# Altium project 3D_Scanner_Final.PrjPcb
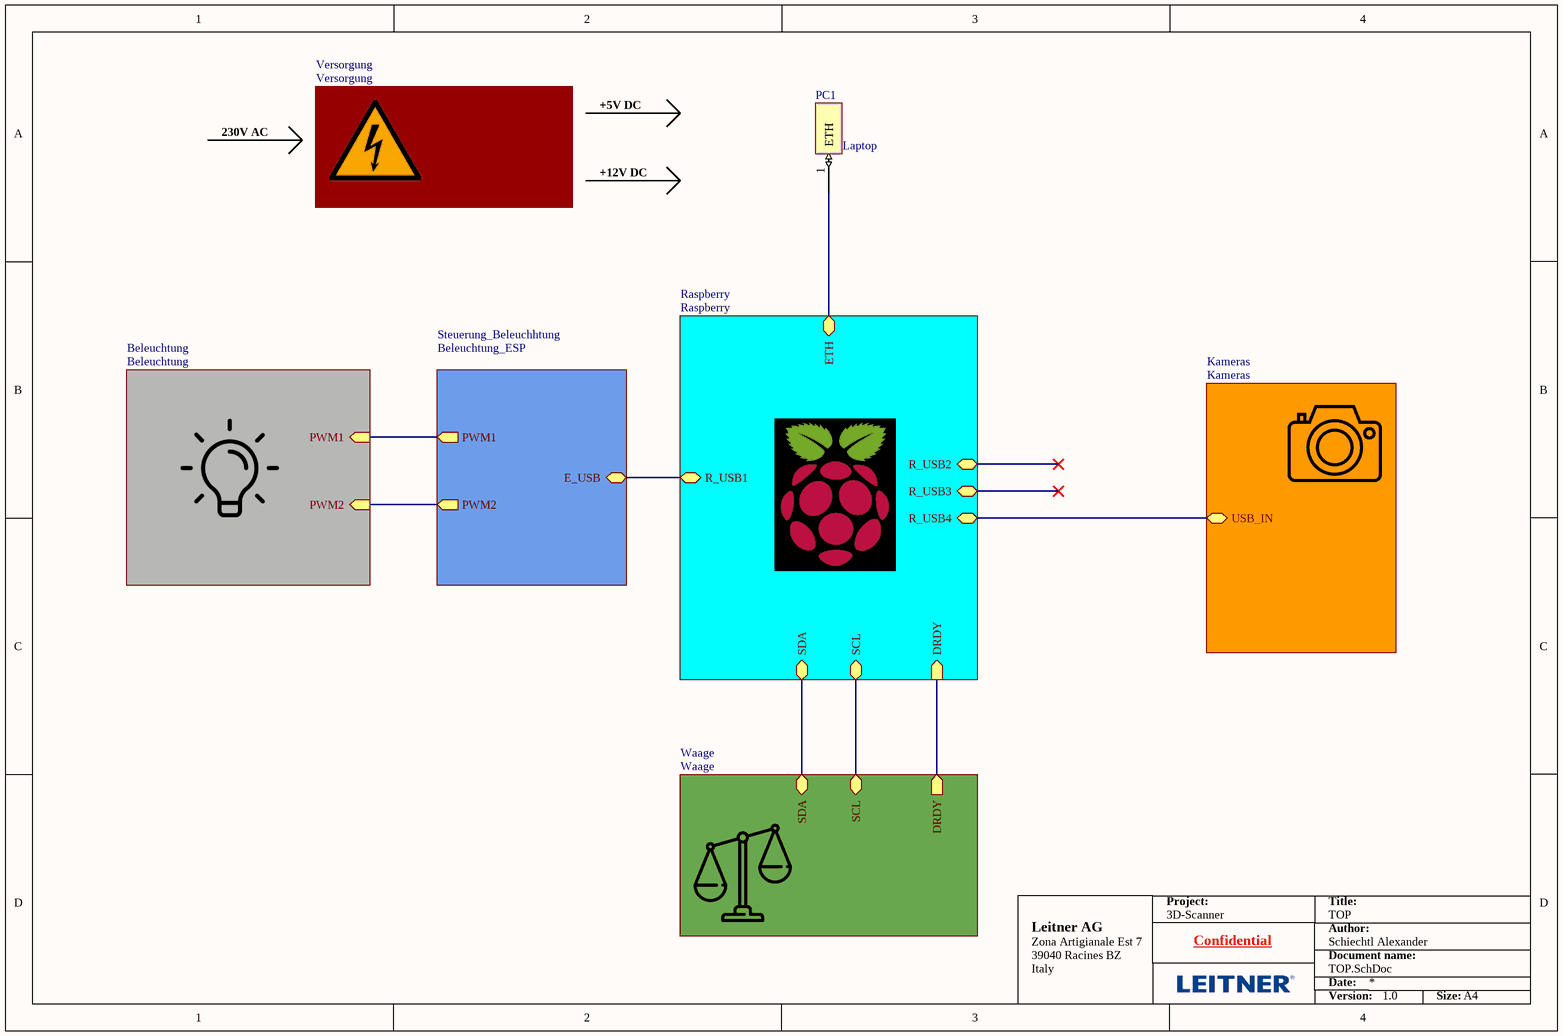
[diagram p0: TOP.SchDoc]
7 sheets, 27 parts. Net scope: hierarchical (ports join the sheet entries above them; power ports are global).
Sheets:
  TOP.SchDoc
    Kameras = Kameras.SchDoc
    Versorgung = Versorgung.SchDoc
    Raspberry = Raspberry.SchDoc
    Waage = Waage.SchDoc
    Beleuchtung = Beleuchtung.SchDoc
    Steuerung_Beleuchhtung = Beleuchtung_ESP.SchDoc

## Sheet TOP.SchDoc: TOP
size A4; Author: Schiechtl Alexander; Revision: 1.0; SheetNumber: 1; SheetTotal: 7; Project: 3D-Scanner

### Parts
PC1  Laptop

### Sub-sheets
Beleuchtung = Beleuchtung: PWM1 (in), PWM2 (in)
Kameras = Kameras: USB_IN (bidir)
Raspberry = Raspberry: R_USB1 (bidir), R_USB2 (bidir), R_USB3 (bidir), R_USB4 (bidir), SCL (bidir), SDA (bidir), DRDY (in), ETH (bidir)
Steuerung_Beleuchhtung = Beleuchtung_ESP: E_USB (bidir), PWM1 (out), PWM2 (out)
Versorgung = Versorgung: no entries
Waage = Waage: SCL (bidir), SDA (bidir), DRDY (out)

### Nets
NetESP1_?1: sheet Raspberry/R_USB1, sheet Steuerung_Beleuchhtung/E_USB
NetHUB1_2: sheet Kameras/USB_IN, sheet Raspberry/R_USB4
NetMUX1_3: sheet Raspberry/SDA, sheet Waage/SDA
NetMUX1_4: sheet Raspberry/SCL, sheet Waage/SCL
NetPC1_1: PC1.1(ETH) ; sheet Raspberry/ETH
NetR_RGB1_2: sheet Beleuchtung/PWM1, sheet Steuerung_Beleuchhtung/PWM1
NetR_RGB2_2: sheet Beleuchtung/PWM2, sheet Steuerung_Beleuchhtung/PWM2

### Buses and harness runs
bus sheet Raspberry/DRDY = sheet Waage/DRDY

### Notes on the sheet
- +5V DC
- 230V AC
- +12V DC
- Project:
- Title:
- Leitner AG
- Zona Artigianale Est 7
- 39040 Racines BZ
- Italy
- Confidential
- Author:
- Document name:
- Date:
- Version:
- Size:
- A4

## Sheet Kameras.SchDoc: Kameras
size A4; Date: 10.11.2025; Author: Schiechtl Alexander; SheetNumber: 2; SheetTotal: 7; Project: 3D_Scanner
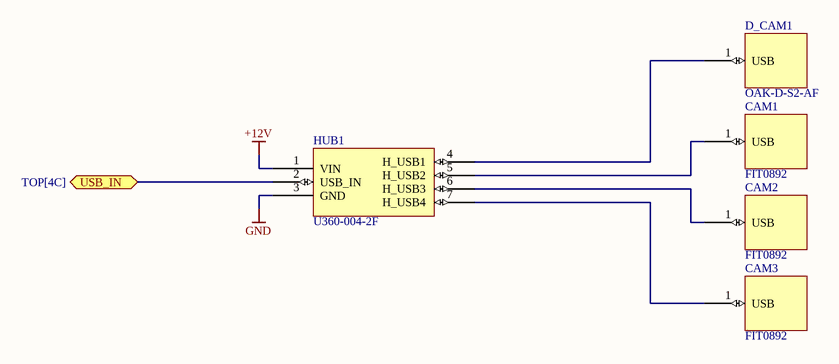
[diagram p1: Kameras.SchDoc]

### Parts
CAM1  FIT0892
CAM2  FIT0892
CAM3  FIT0892
D_CAM1  OAK-D-S2-AF
HUB1  U360-004-2F

### Ports
USB_IN (bidir, see TOP[4C])

### Nets
+12V: HUB1.1(VIN)
GND: HUB1.3(GND)
NetCAM1_1: CAM1.1(USB) HUB1.5(H_USB2)
NetCAM2_1: CAM2.1(USB) HUB1.6(H_USB3)
NetCAM3_1: CAM3.1(USB) HUB1.7(H_USB4)
NetD_CAM1_1: D_CAM1.1(USB) HUB1.4(H_USB1)
NetHUB1_2: HUB1.2(USB_IN) ; port USB_IN

### Notes on the sheet
- Project:
- Title:
- Leitner AG
- Zona Artigianale Est 7
- 39040 Racines BZ
- Italy
- Confidential
- Author:
- Document name:
- Date:
- Version:
- Size:
- A4

### Library data of the parts
CAM1-CAM3 = USB Kamera: Cameras & Camera Modules Megapixel 720p USB Wide-angle Camera for Raspberry Pi and NVIDIA Jetson Nano
D_CAM1 = Depth Kamera: Cameras & Camera Modules Robotic Perception Camera Series 2 with Auto Fcous, Stereo Depth, Object Tracking, Computer Vision, 4 TOPS of Processing Power for AI
HUB1 = USB HUB: Interface Modules 4PT USB3.0 SSSPD HUB/CHARGER

## Sheet Versorgung.SchDoc: Netzteil
size A4; Date: 10.11.2025; Author: Alexander Schiechtl; Revision: v1.0; SheetNumber: 4; SheetTotal: 6; Project: 3D-Scanner
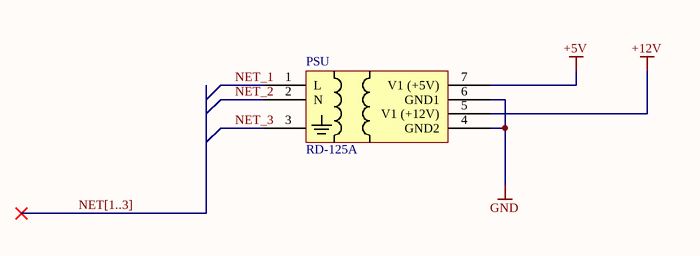
[diagram p2: Versorgung.SchDoc]

### Parts
PSU  RD-125A

### Nets
+5V: PSU.7(V1_(+5V))
+12V: PSU.5(V1_(+12V))
GND: PSU.4(GND2) PSU.6(GND1)
NET_1: PSU.1(L)
NET_2: PSU.2(N)
NET_3: PSU.3

### Buses and harness runs
bus NET[1..3]

### Notes on the sheet
- Project:
- Title:
- Leitner AG
- Zona Artigianale Est 7
- 39040 Racines BZ
- Italy
- Confidential
- Author:
- Document name:
- Date:
- Version:
- Size:
- A4

### Library data of the parts
PSU = PSU: MEAN WELL Schaltnetzteil, 5 V dc, 12 V dc / 7.7A 2-Kanal 130.9W 176 → 264 V ac, 248 → 373 V dc, 88

## Sheet Raspberry.SchDoc: Raspberry PI
size A4; Date: 10.11.2025; Author: Alexander Schiechtl; Revision: v1.1; SheetNumber: 3; SheetTotal: 7; Project: 3D-Scanner; SPICEModelCacheFICJDGAN: <root> / <DocumentId>FICJDGAN</DocumentId> / </root>
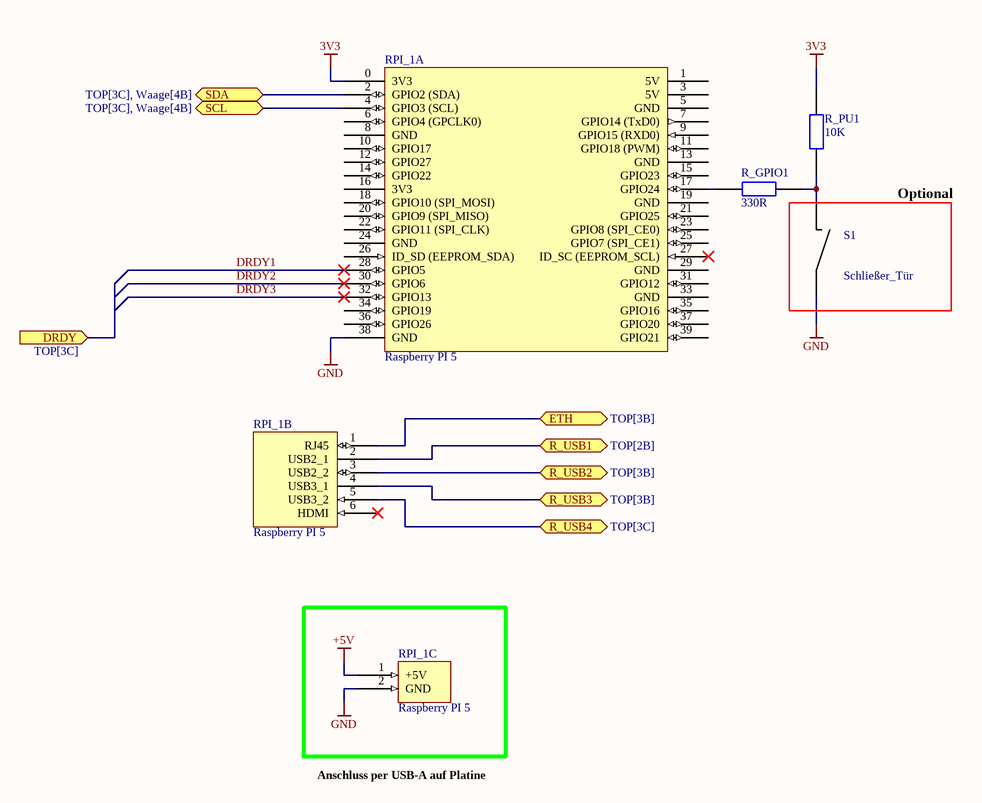
[diagram p3: Raspberry.SchDoc]

### Parts
(Parts that share a designator on the sheet are numbered #1, #2 ... from top to bottom, then left to right.)
R_GPIO1  330R
R_PU1  10K
RPI_1#1  Raspberry PI 5  (parts A,B of 2)
RPI_1#2  Raspberry PI 5  (part C of 3)
S1  Schließer_Tür

### Blocks framed on the sheet
Optional: S1

### Ports
DRDY (in, see TOP[3C]), ETH (bidir, see TOP[3B]), R_USB1 (bidir, see TOP[2B]), R_USB2 (bidir, see TOP[3B]), R_USB3 (bidir, see TOP[3B]), R_USB4 (bidir, see TOP[3C]), SCL (bidir, see TOP[3C], Waage[4B]), SDA (bidir, see TOP[3C], Waage[4B])

### Nets
3V3: R_PU1.1 RPI_1#1.0(3V3)
+5V: RPI_1#2.1(+5V)
GND: RPI_1#1.38(GND) RPI_1#2.2(GND)
DRDY1: RPI_1#1.28(GPIO5)
DRDY2: RPI_1#1.30(GPIO6)
DRDY3: RPI_1#1.32(GPIO13)
NetESP1_?1: RPI_1#1.2(USB2_1) ; port R_USB1
NetHUB1_2: RPI_1#1.5(GND) ; port R_USB4
NetMUX1_3: RPI_1#1.2(GPIO2_(SDA)) ; port SDA
NetMUX1_4: RPI_1#1.4(GPIO3_(SCL)) ; port SCL
NetPC1_1: RPI_1#1.1(5V) ; port ETH
NetR_GPIO1_0: R_GPIO1.0 R_PU1.0
NetR_GPIO1_1: R_GPIO1.1 RPI_1#1.17(GPIO24)
NetRPI_1#1_3: RPI_1#1.3(5V) ; port R_USB2
NetRPI_1#1_4: RPI_1#1.4(USB3_1) ; port R_USB3

Not connected (* = marked no-connect by the designer): RPI_1#1 6(GPIO4_(GPCLK0)) 7(GPIO14_(TxD0)) 8(GND) 9(GPIO15_(RXD0)) 10(GPIO17) 11(GPIO18_(PWM)) 12(GPIO27) 13(GND) 14(GPIO22) 15(GPIO23) 16(3V3) 18(GPIO10_(SPI_MOSI)) 19(GND) 20(GPIO9_(SPI_MISO)) 21(GPIO25) 22(GPIO11_(SPI_CLK)) 23(GPIO8_(SPI_CE0)) 24(GND) 25(GPIO7_(SPI_CE1)) 26(ID_SD_(EEPROM_SDA)) 27(ID_SC_(EEPROM_SCL))* 29(GND) 31(GPIO12) 33(GND) 34(GPIO19) 35(GPIO16) 36(GPIO26) 37(GPIO20) 39(GPIO21)

### Notes on the sheet
- Anschluss per USB-A auf Platine
- Project:
- Title:
- Leitner AG
- Zona Artigianale Est 7
- 39040 Racines BZ
- Italy
- Confidential
- Author:
- Document name:
- Date:
- Version:
- Size:
- A4

### Library data of the parts
R_GPIO1 = R 330: Widerstand: 330R
R_PU1 = R 10K: Widerstand: 10K
RPI_1#1 = Raspberry PI
RPI_1#2 = Raspberry PI: Versorgung, USB-C
S1 = S_Schließer

## Sheet Waage.SchDoc: Waage
size A4; Date: 10.11.2025; Author: Alexander Schiechtl; Revision: v1.0; SheetNumber: 5; SheetTotal: 7; Project: 3D-Scanner
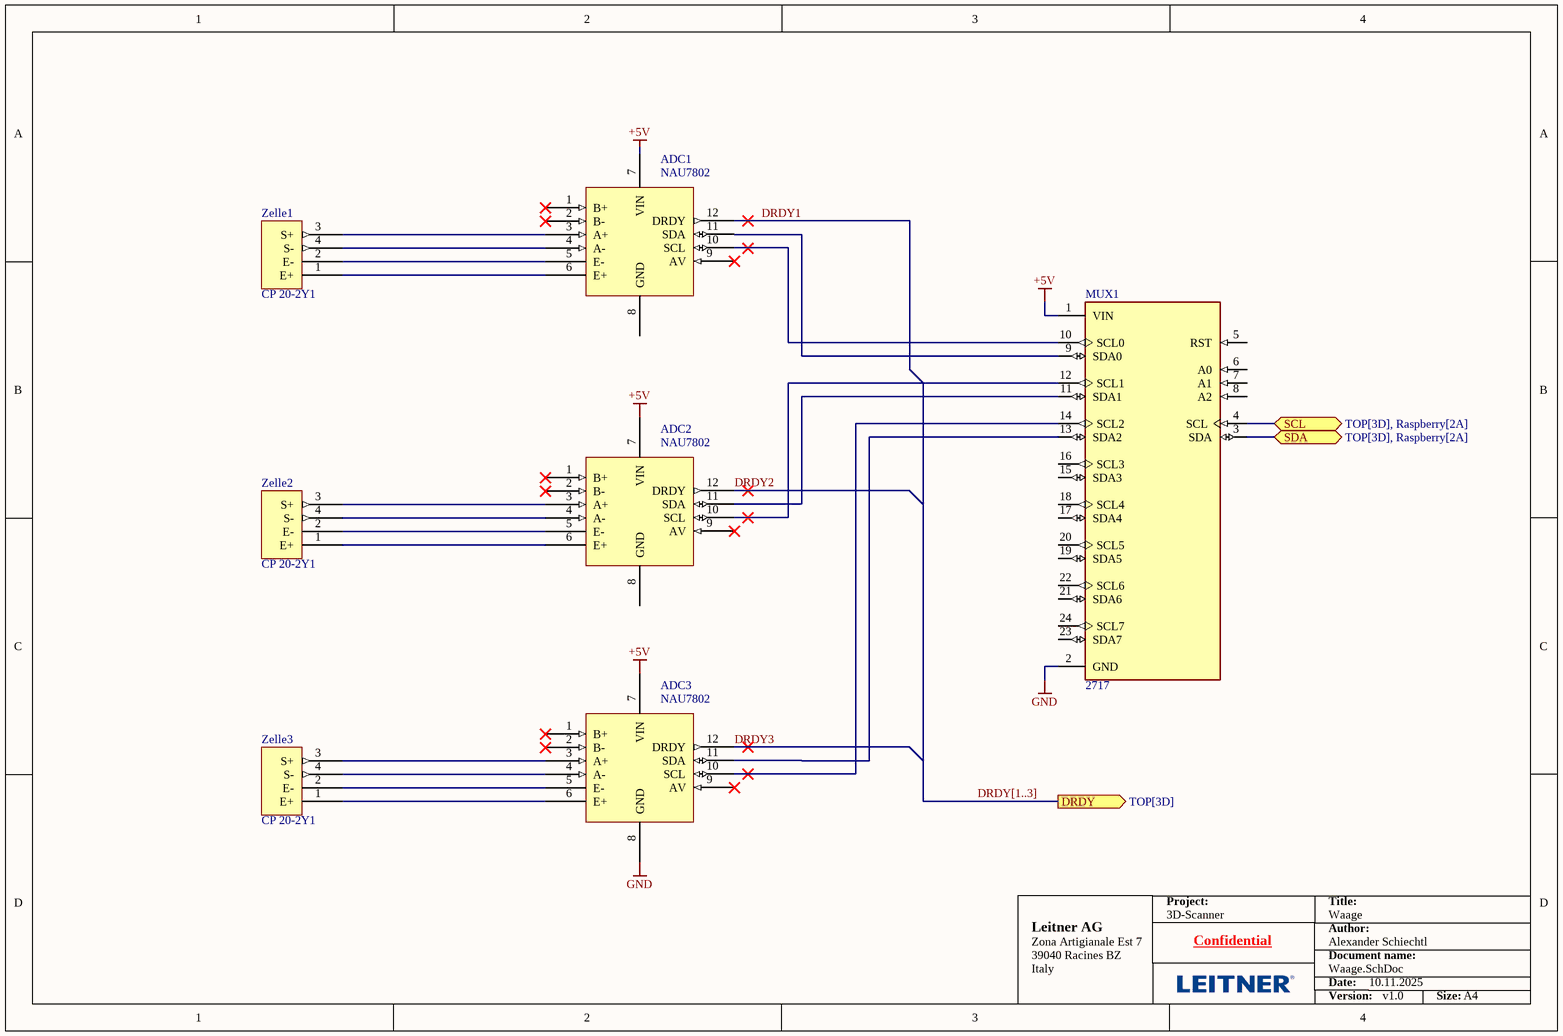
[diagram p4: Waage.SchDoc]

### Parts
ADC1  NAU7802
ADC2  NAU7802
ADC3  NAU7802
MUX1  2717  [MODULE_2717]
Zelle1  CP 20-2Y1
Zelle2  CP 20-2Y1
Zelle3  CP 20-2Y1

### Ports
DRDY (out, see TOP[3D]), SCL (bidir, see TOP[3D], Raspberry[2A]), SDA (bidir, see TOP[3D], Raspberry[2A])

### Nets
+5V: ADC1.7(VIN) ADC2.7(VIN) ADC3.7(VIN) MUX1.1(VIN)
GND: ADC3.8(GND) MUX1.2(GND)
DRDY1: ADC1.12(DRDY)
DRDY2: ADC2.12(DRDY)
DRDY3: ADC3.12(DRDY)
NetADC1_3: ADC1.3(A+) Zelle1.3(S+)
NetADC1_4: ADC1.4(A-) Zelle1.4(S-)
NetADC1_5: ADC1.5(E-) Zelle1.2(E-)
NetADC1_6: ADC1.6(E+) Zelle1.1(E+)
NetADC1_10: ADC1.10(SCL) MUX1.10(SCL0)
NetADC1_11: ADC1.11(SDA) MUX1.9(SDA0)
NetADC2_3: ADC2.3(A+) Zelle2.3(S+)
NetADC2_4: ADC2.4(A-) Zelle2.4(S-)
NetADC2_5: ADC2.5(E-) Zelle2.2(E-)
NetADC2_6: ADC2.6(E+) Zelle2.1(E+)
NetADC2_10: ADC2.10(SCL) MUX1.12(SCL1)
NetADC2_11: ADC2.11(SDA) MUX1.11(SDA1)
NetADC3_3: ADC3.3(A+) Zelle3.3(S+)
NetADC3_4: ADC3.4(A-) Zelle3.4(S-)
NetADC3_5: ADC3.5(E-) Zelle3.2(E-)
NetADC3_6: ADC3.6(E+) Zelle3.1(E+)
NetADC3_10: ADC3.10(SCL) MUX1.14(SCL2)
NetADC3_11: ADC3.11(SDA) MUX1.13(SDA2)
NetMUX1_3: MUX1.3(SDA) ; port SDA
NetMUX1_4: MUX1.4(SCL) ; port SCL

Not connected (* = marked no-connect by the designer): ADC1 1(B+)* 2(B-)* 8(GND) 9(AV)*; ADC2 1(B+)* 2(B-)* 8(GND) 9(AV)*; ADC3 1(B+)* 2(B-)* 9(AV)*; MUX1 5(RST) 6(A0) 7(A1) 8(A2) 15(SDA3) 16(SCL3) 17(SDA4) 18(SCL4) 19(SDA5) 20(SCL5) 21(SDA6) 22(SCL6) 23(SDA7) 24(SCL7)

### Buses and harness runs
bus DRDY[1..3] = port DRDY

### Notes on the sheet
- Project:
- Title:
- Leitner AG
- Zona Artigianale Est 7
- 39040 Racines BZ
- Italy
- Confidential
- Author:
- Document name:
- Date:
- Version:
- Size:
- A4

### Library data of the parts
ADC1-ADC3 = ADC: ADAFRUIT NAU7802 24-BIT ADC - ST
MUX1 = 2717: Module: multiplexer; I2C interface multiplexer; TCA9548A; 3Ã·5VDC; MF: Adafruit; SnapEDA_Link: https://www.snapeda.com/parts/2717/Adafruit+Industries/view-part/?ref=snap; Package: None; Value: *; MP: 2717; Check_prices: https://www.snapeda.com/parts/2717/Adafruit+Industries/view-part/?ref=eda
Zelle1-Zelle3 = Wägezelle: Kern CP 20-2Y1 Wägezelle

## Sheet Beleuchtung.SchDoc: Beleuchtung
size A4; Date: 10.11.2025; Author: Alexander Schiechtl; Revision: v1.0; SheetNumber: 7; SheetTotal: 7; Project: 3D-Scanner
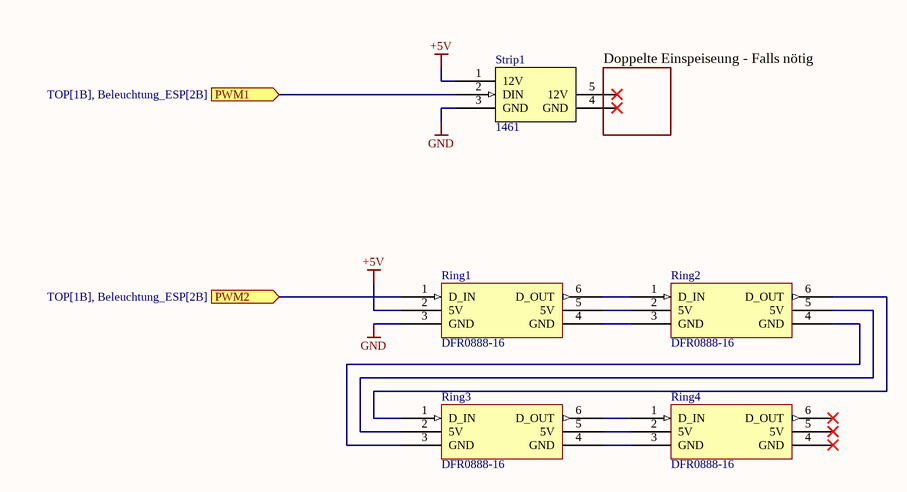
[diagram p5: Beleuchtung.SchDoc]

### Parts
Ring1  DFR0888-16
Ring2  DFR0888-16
Ring3  DFR0888-16
Ring4  DFR0888-16
Strip1  1461

### Ports
PWM1 (in, see TOP[1B], Beleuchtung_ESP[2B]), PWM2 (in, see TOP[1B], Beleuchtung_ESP[2B])

### Nets
+5V: Ring1.2(5V) Strip1.1(12V)
GND: Ring1.3(GND) Strip1.3(GND)
NetR_RGB1_2: Strip1.2(DIN) ; port PWM1
NetR_RGB2_2: Ring1.1(D_IN) ; port PWM2
NetRing1_4: Ring1.4(GND) Ring2.3(GND)
NetRing1_5: Ring1.5(5V) Ring2.2(5V)
NetRing1_6: Ring1.6(D_OUT) Ring2.1(D_IN)
NetRing2_4: Ring2.4(GND) Ring3.3(GND)
NetRing2_5: Ring2.5(5V) Ring3.2(5V)
NetRing2_6: Ring2.6(D_OUT) Ring3.1(D_IN)
NetRing3_4: Ring3.4(GND) Ring4.3(GND)
NetRing3_5: Ring3.5(5V) Ring4.2(5V)
NetRing3_6: Ring3.6(D_OUT) Ring4.1(D_IN)

Not connected (* = marked no-connect by the designer): Ring4 4(GND)* 5(5V)* 6(D_OUT)*; Strip1 4(GND)* 5(12V)*

### Notes on the sheet
- (near Strip1) Doppelte Einspeiseung - Falls nötig
- Project:
- Title:
- Leitner AG
- Zona Artigianale Est 7
- 39040 Racines BZ
- Italy
- Confidential
- Author:
- Document name:
- Date:
- Version:
- Size:
- A4

### Library data of the parts
Ring1-Ring4 = RGB Ring: DFRobot, DFR0888-16. / WS2812-16 RGB LED RING LAMP
Strip1 = RGB Strip: ADDRESS LED STRIP SERIAL RGB 4M, Adafruit, 1461

## Sheet Beleuchtung_ESP.SchDoc: Steuerung Beleuchtung
size A4; Date: 10.11.2025; Author: Alexander Schiechtl; Revision: v1.0; SheetNumber: 6; SheetTotal: 7; Project: 3D-Scanner
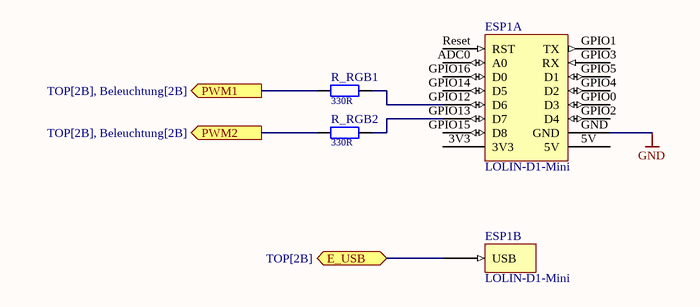
[diagram p6: Beleuchtung_ESP.SchDoc]

### Parts
ESP1  LOLIN-D1-Mini  (parts A,B of 2)
R_RGB1  330R  [R_0207/RM4]
R_RGB2  330R  [R_0207/RM4]

### Ports
E_USB (bidir, see TOP[2B]), PWM1 (out, see TOP[2B], Beleuchtung[2B]), PWM2 (out, see TOP[2B], Beleuchtung[2B])

### Nets
GND: ESP1.GND
NetESP1_?1: ESP1.?1(USB) ; port E_USB
NetESP1_GPIO12: ESP1.GPIO12(D6) R_RGB1.1
NetESP1_GPIO13: ESP1.GPIO13(D7) R_RGB2.1
NetR_RGB1_2: R_RGB1.2 ; port PWM1
NetR_RGB2_2: R_RGB2.2 ; port PWM2

Not connected (* = marked no-connect by the designer): ESP1 3V3 5V ADC0(A0) GPIO0(D3) GPIO1(TX) GPIO2(D4) GPIO3(RX) GPIO4(D2) GPIO5(D1) GPIO14(D5) GPIO15(D8) GPIO16(D0) Reset(RST)

### Notes on the sheet
- Project:
- Title:
- Leitner AG
- Zona Artigianale Est 7
- 39040 Racines BZ
- Italy
- Confidential
- Author:
- Document name:
- Date:
- Version:
- Size:
- A4

### Library data of the parts
R_RGB1 R_RGB2 = R: Resistor; Usage: only permitted for non-commercial purposes at HTL I Innsbruck; Published: 21-Feb-2011; LatestRevisionDate: 07-Sep-2019; Value: 330R

## Nets that join several sheets
+5V: Versorgung (PSU.7), Raspberry (RPI_1#2.1), Waage (ADC1.7 ADC2.7 ADC3.7 MUX1.1), Beleuchtung (Ring1.2 Strip1.1)
+12V: Kameras (HUB1.1), Versorgung (PSU.5)
GND: Kameras (HUB1.3), Versorgung (PSU.4 PSU.6), Raspberry (RPI_1#1.38 RPI_1#2.2), Waage (ADC3.8 MUX1.2), Beleuchtung (Ring1.3 Strip1.3), Beleuchtung_ESP (ESP1.GND)
NetESP1_?1: Raspberry (RPI_1#1.2), Beleuchtung_ESP (ESP1.?1)
NetHUB1_2: Kameras (HUB1.2), Raspberry (RPI_1#1.5)
NetMUX1_3: Raspberry (RPI_1#1.2), Waage (MUX1.3)
NetMUX1_4: Raspberry (RPI_1#1.4), Waage (MUX1.4)
NetPC1_1: TOP (PC1.1), Raspberry (RPI_1#1.1)
NetR_RGB1_2: Beleuchtung (Strip1.2), Beleuchtung_ESP (R_RGB1.2)
NetR_RGB2_2: Beleuchtung (Ring1.1), Beleuchtung_ESP (R_RGB2.2)